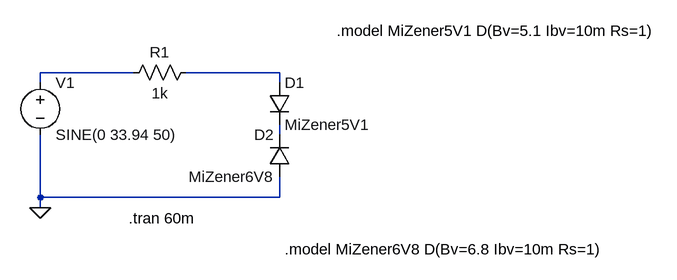
[diagram p0: schematic TP2DEzenner2.asc]
TP2DEzenner2.asc, the LTspice schematic file:
Version 4.1
SHEET 1 2748 680
WIRE 112 96 -32 96
WIRE 336 96 192 96
WIRE -32 112 -32 96
WIRE 336 112 336 96
WIRE 336 192 336 176
WIRE -32 288 -32 192
WIRE 336 288 336 256
WIRE 336 288 -32 288
WIRE -32 304 -32 288
FLAG -32 304 0
SYMBOL res 208 80 R90
WINDOW 0 0 56 VBottom 2
WINDOW 3 32 56 VTop 2
SYMATTR InstName R1
SYMATTR Value 1k
SYMBOL voltage -32 96 R0
WINDOW 123 0 0 Left 0
WINDOW 39 0 0 Left 0
SYMATTR InstName V1
SYMATTR Value SINE(0 33.94 50)
SYMBOL diode 320 112 R0
SYMATTR InstName D1
SYMATTR Value MiZener5V1
SYMATTR Description Diode
SYMATTR Type diode
SYMBOL diode 352 256 R180
WINDOW 0 24 64 Left 2
WINDOW 3 24 0 Left 2
SYMATTR InstName D2
SYMATTR Value MiZener6V8
SYMATTR Description Diode
SYMATTR Type diode
TEXT 104 320 Left 2 !.tran 60m
TEXT 424 32 Left 2 !.model MiZener5V1 D(Bv=5.1 Ibv=10m Rs=1)
TEXT 344 368 Left 2 !.model MiZener6V8 D(Bv=6.8 Ibv=10m Rs=1)

The netlist it stands for:
* TP2DEzenner2.asc
R1 N002 N001 1k
V1 N001 0 SINE(0 33.94 50)
D1 N002 N003 MiZener5V1
D2 0 N003 MiZener6V8
.model D D
.lib standard.dio
.tran 60m
.model MiZener5V1 D(Bv=5.1 Ibv=10m Rs=1)
.model MiZener6V8 D(Bv=6.8 Ibv=10m Rs=1)
.backanno
.end